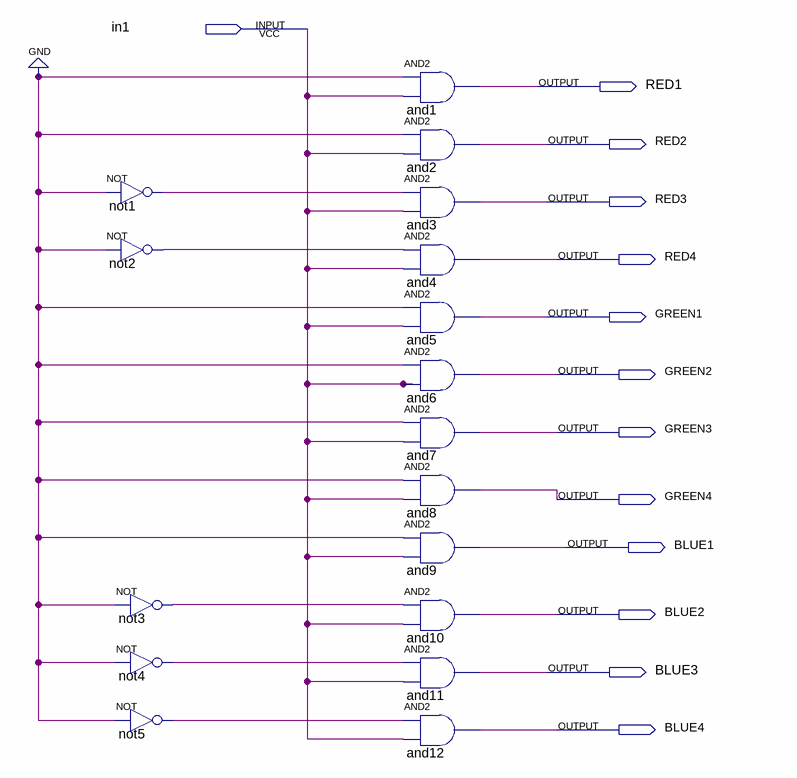
[diagram p0: schematic sheet]
// Quartus schematic pink_1.bdf as structural Verilog: 17 symbols, 13 pins
module pink_1 (
  input  in1,
  output RED1,
  output RED2,
  output RED3,
  output RED4,
  output GREEN1,
  output GREEN2,
  output GREEN3,
  output GREEN4,
  output BLUE1,
  output BLUE2,
  output BLUE3,
  output BLUE4
);

  wire not1_out, not2_out, not3_out, not4_out, not5_out;

  not not1 (not1_out, 1'b0);
  not not2 (not2_out, 1'b0);
  not not3 (not3_out, 1'b0);
  not not4 (not4_out, 1'b0);
  not not5 (not5_out, 1'b0);
  and and1 (RED1, 1'b0, in1);
  and and2 (RED2, 1'b0, in1);
  and and3 (RED3, not1_out, in1);
  and and4 (RED4, not2_out, in1);
  and and5 (GREEN1, 1'b0, in1);
  and and6 (GREEN2, 1'b0, in1);
  and and7 (GREEN3, 1'b0, in1);
  and and8 (GREEN4, 1'b0, in1);
  and and9 (BLUE1, 1'b0, in1);
  and and10 (BLUE2, not3_out, in1);
  and and11 (BLUE3, not4_out, in1);
  and and12 (BLUE4, not5_out, in1);
endmodule
